# EAGLE design Power module Mini (EAGLE 9.6.1)
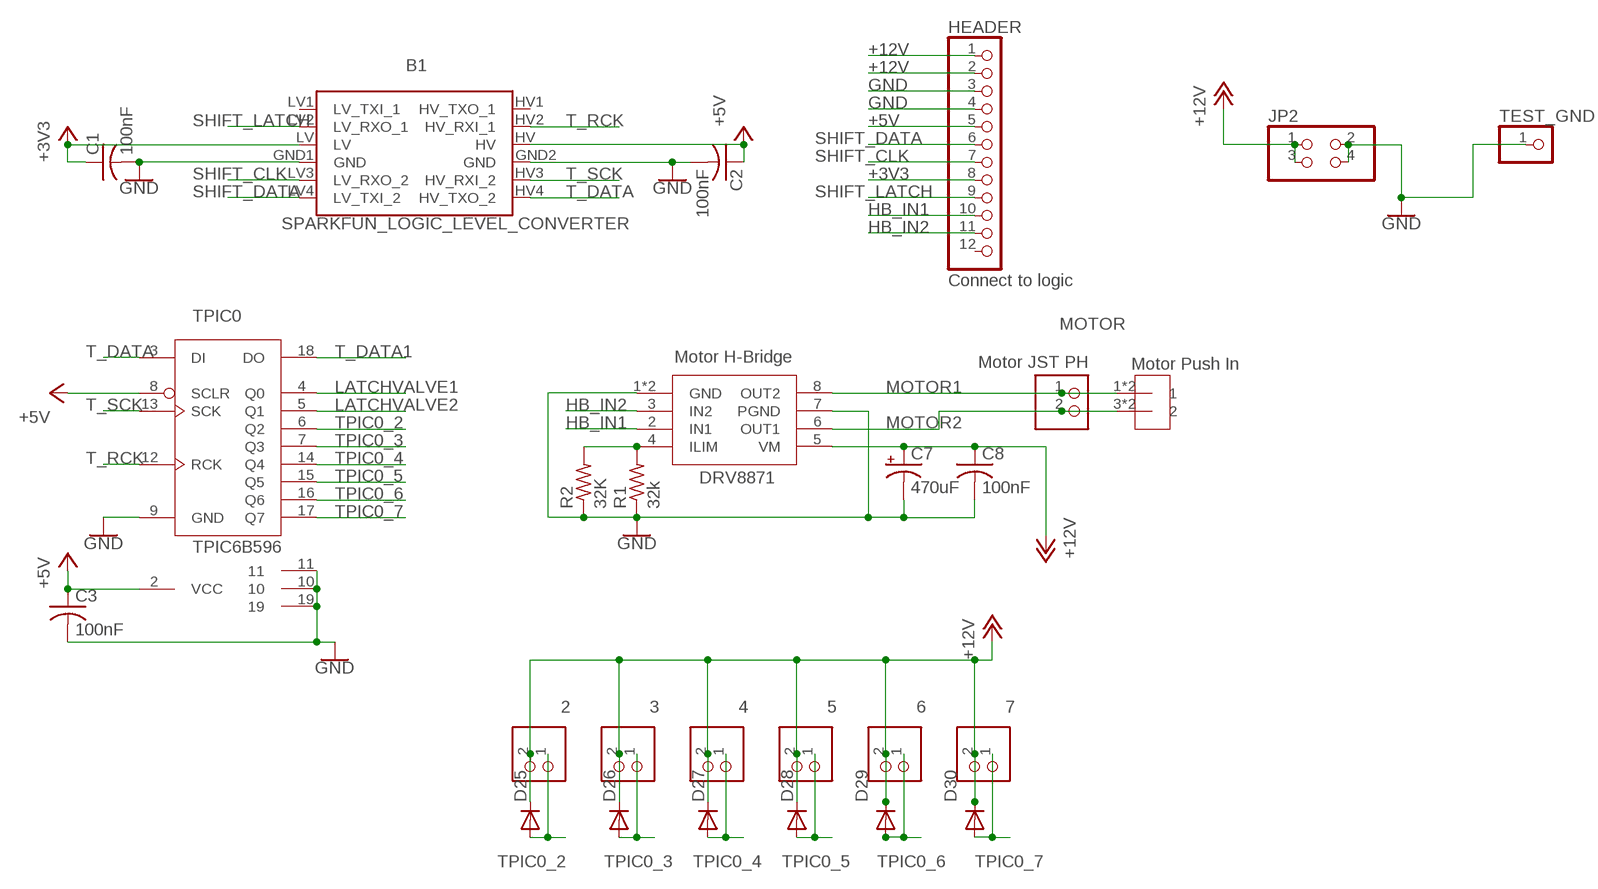
[diagram p0: schematic, sheet 1]

## Parts
2  2.5MM_JST_UP_2POS  [JST_2POS_2.5MM_UP]
3  2.5MM_JST_UP_2POS  [JST_2POS_2.5MM_UP]
4  2.5MM_JST_UP_2POS  [JST_2POS_2.5MM_UP]
5  2.5MM_JST_UP_2POS  [JST_2POS_2.5MM_UP]
6  2.5MM_JST_UP_2POS  [JST_2POS_2.5MM_UP]
7  2.5MM_JST_UP_2POS  [JST_2POS_2.5MM_UP]
B1  SPARKFUN_LOGIC_LEVEL_CONVERTER  [SPARKFUN_LOGIC_LEVEL_CONVERTER]
C1  100nF  C-USC1206  [C1206]
C2  100nF  C-USC1206  [C1206]
C3  100nF  C-USC1206  [C1206]
C7  470uF  CPOL-US140CLH-0810  [140CLH-0810]
C8  100nF  C-USC1206  [C1206]
D25  DIODESOD-123  [SOD-123]
D26  DIODESOD-123  [SOD-123]
D27  DIODESOD-123  [SOD-123]
D28  DIODESOD-123  [SOD-123]
D29  DIODESOD-123  [SOD-123]
D30  DIODESOD-123  [SOD-123]
DRV8871  Motor H-Bridge  DRV8871  [SOP8]
HEADER  Connect to logic  PINHD-1X12  [1X12]
JP2  PINHD-2X2  [2X02]
MOTOR  Motor JST PH  2.5MM_JST_UP_2POS  [JST_2POS_2.5MM_UP]
R1  32k  R-US_0204/5  [0204/5]
R2  32K  R-US_R0805  [R0805]
TEST_GND  PINHD-1X1  [1X01]
TPIC0  TPIC6B596  [DIP20]
U$1  Motor Push In  PUSH_IN_2  [3.5MM_DIP2]

## Nets
+3V3: B1.LV C1.1 HEADER.8
+5V: B1.HV C2.1 C3.1 HEADER.5 TPIC0.2(VCC) TPIC0.8(SCLR)
+12V: 2.2 3.2 4.2 5.2 6.2 7.2 C7.+ C8.1 D25.C D26.C D27.C D28.C D29.C D30.C DRV8871.5(VM) HEADER.1 HEADER.2 JP2.1 JP2.3
GND: B1.GND1(GND) B1.GND2(GND) C1.2 C2.2 C3.2 C7.- C8.2 DRV8871.1(GND) DRV8871.7(PGND) DRV8871.GND HEADER.3 HEADER.4 JP2.2 JP2.4 R1.1 R2.1 TEST_GND.1 TPIC0.9(GND) TPIC0.10 TPIC0.11 TPIC0.19
HB_IN1: DRV8871.2(IN1) HEADER.10
HB_IN2: DRV8871.3(IN2) HEADER.11
LATCHVALVE1: TPIC0.4(Q0)
LATCHVALVE2: TPIC0.5(Q1)
MOTOR1: DRV8871.8(OUT2) MOTOR.1 U$1.1 U$1.2
MOTOR2: DRV8871.6(OUT1) MOTOR.2 U$1.3 U$1.4
N$2: DRV8871.4(ILIM) R1.2 R2.2
SHIFT_CLK: B1.LV3(LV_RXO_2) HEADER.7
SHIFT_DATA: B1.LV4(LV_TXI_2) HEADER.6
SHIFT_LATCH: B1.LV2(LV_RXO_1) HEADER.9
T_DATA: B1.HV4(HV_TXO_2) TPIC0.3(DI)
T_DATA1: TPIC0.18(DO)
T_RCK: B1.HV2(HV_RXI_1) TPIC0.12(RCK)
T_SCK: B1.HV3(HV_RXI_2) TPIC0.13(SCK)
TPIC0_2: 2.1 D25.A TPIC0.6(Q2)
TPIC0_3: 3.1 D26.A TPIC0.7(Q3)
TPIC0_4: 4.1 D27.A TPIC0.14(Q4)
TPIC0_5: 5.1 D28.A TPIC0.15(Q5)
TPIC0_6: 6.1 D29.A TPIC0.16(Q6)
TPIC0_7: 7.1 D30.A TPIC0.17(Q7)
Unconnected: B1.HV1(HV_TXO_1) B1.LV1(LV_TXI_1) HEADER.12

## Library data of the parts
2-7 MOTOR = eDNA:2.5MM_JST_UP_2POS
B1 = SparkFun-Boards:SPARKFUN_LOGIC_LEVEL_CONVERTER: SparkFun Logic Level Converter -Bi-Directional This is the mechnical outline for the 3.3V - 5V bi directional logic level converter. *Note, the "LOCK" Package has the header pins staggered by an offset of 5 mils (off center line), so that when you slide a row of standard 0.1" headers into the PTH pads, it will hold position vertically. See the follwing turorial for more information on this type of special footprints: Sneaky Footprints <https://www.sparkfun.com/tutorials/114> SparkFun Products: SparkFun Logic Level Converter - Bi-Directional <https://www.sparkfun.com/products/12009>
C1-C3 C8 = rcl:C-US: CAPACITOR, American symbol; SPICEPREFIX: C
C7 = adafruit:CPOL-US: POLARIZED CAPACITOR, American symbol
D25-D30 = adafruit:DIODE: Diode SMADIODE - SMA Surface Mount Package 20V 1A Schottky Diode Digikey: 641-1014-6-ND DO-1N4148 - Through Hole Small Current Diode SOD-123 20V 1 A (.5mV Vf) Schottky Diode - Digikey: MBRX120TPMSCT-ND SOD-323 10V 570mA (.38mV Vf, 3ns) Schottky Diode - Digikey: ZLLS410CT-ND SOD-523 30V 30mA Schottky Diode (RB751S-40TE61) - Digikey: RB751S-40TE61CT-ND SOT23-R/W - SOT23 Package (R = Solder Paste/Reflow Ovens, W = Hand-Soldering) BAT54Film 40V 300mA - Digikey: 497-7162-1-ND
DRV8871 = eDNA:DRV8871
HEADER = adafruit:PINHD-1X12: PIN HEADER
JP2 = pinhead:PINHD-2X2: PIN HEADER
R1 = adafruit:R-US_: RESISTOR, American symbol
R2 = rcl:R-US_: RESISTOR, American symbol; SPICEPREFIX: R
TEST_GND = pinhead:PINHD-1X1: PIN HEADER
TPIC0 = eDNA:TPIC6B596
U$1 = eDNA:PUSH_IN_2: Push in to connect Phoenix Contact - 3.5 mm through hole Can be ordered from : https://www.digikey.com/product-detail/en/phoenix-contact/1864286/277-12184-ND/6605434 OpenSensingLab OSU

## Board
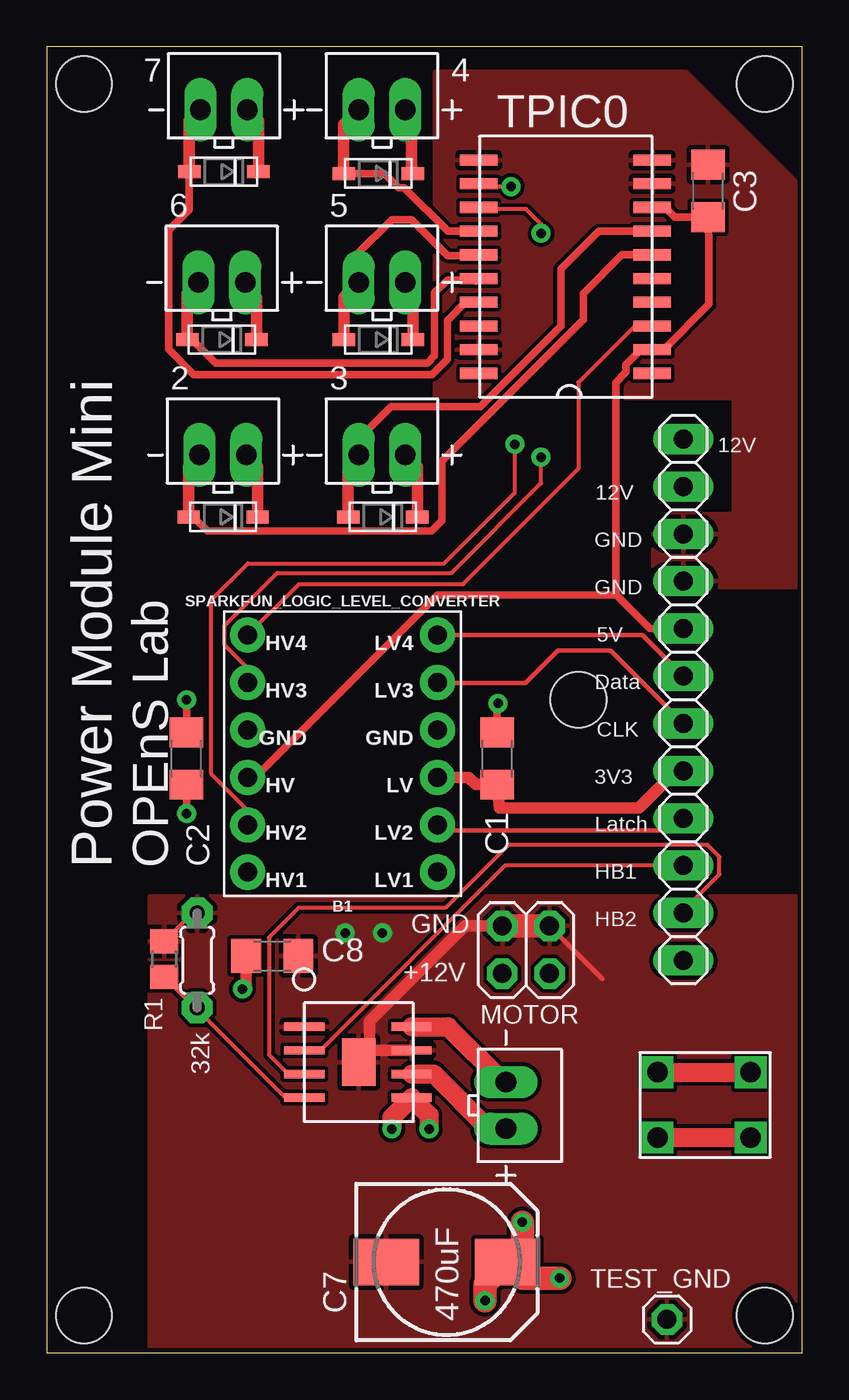
[diagram p1: board, top side]
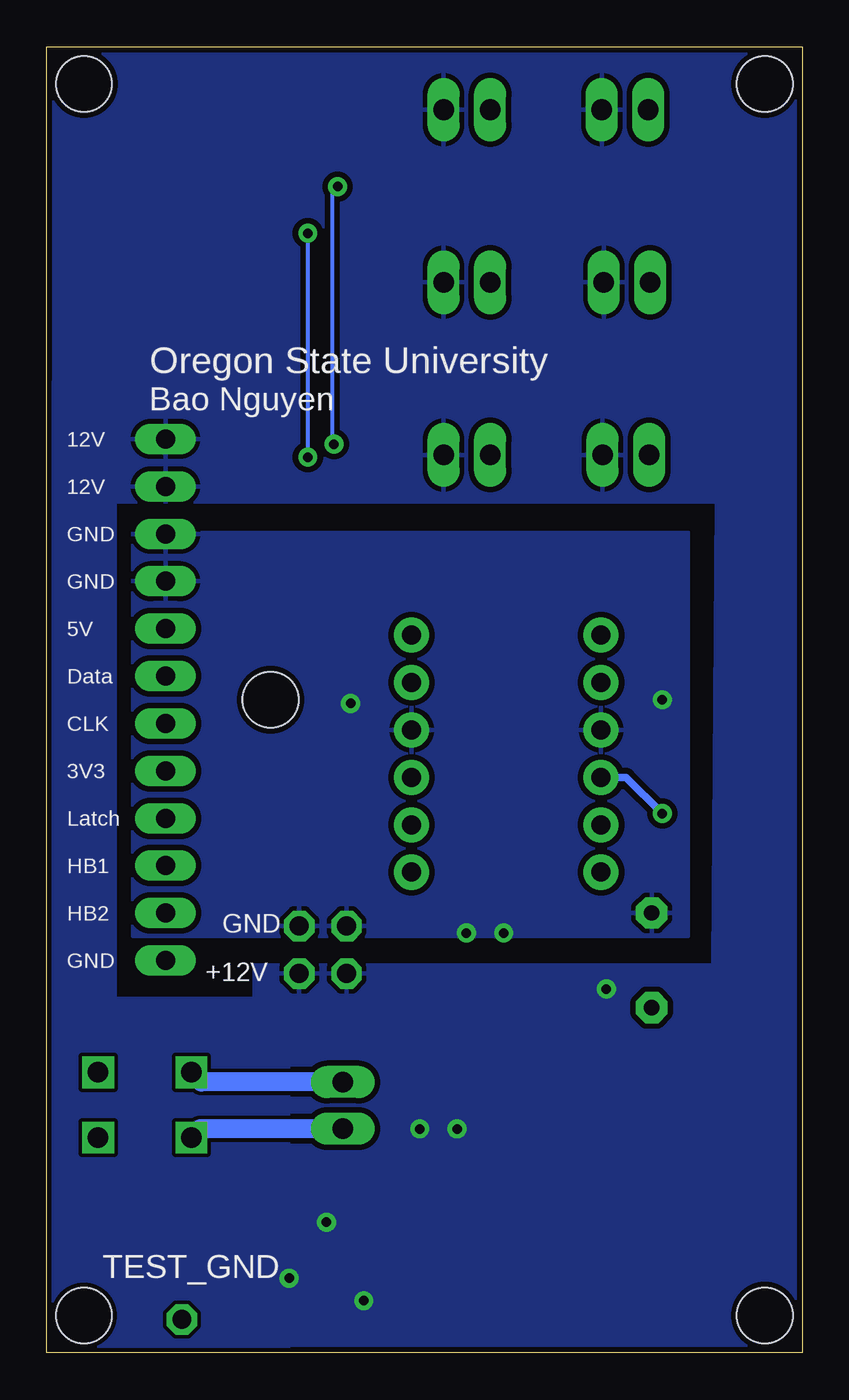
[diagram p2: board, bottom side, seen from below]

Size 40.5 x 70 mm. Coordinates in mm from the lower left corner, seen from the top.
Outline: 0,0 40.5,0 40.5,70 0,70 0,0
Copper layers (1*16): Top 0.035mm / dielectric 1.5mm / Bottom 0.035mm
Design rules "SparkFun": minimum track width 8mil, minimum drill 20mil, track to track 8mil, track to pad 8mil, pad to pad 8mil, via to via 8mil, smd to smd 8mil, copper to edge 10mil, drill to drill 8mil, minimum pad ring 12mil, minimum via ring 10mil, stop-mask expansion 4mil, vias tented up to drill 25mil, thermal gap 10mil
Holes 3 mm at 38.5,68 38.5,2 2,2 2,68 28.5,35

### Footprints (pad centres in the part's own frame; a part is rotated, then mirrored left to right if it is on the bottom)
JST_2POS_2.5MM_UP = drill 1.1 long: 1 -1.25,0; 2 1.25,0
SPARKFUN_LOGIC_LEVEL_CONVERTER = drill 1.016 pad 1.88: GND1 -5.08,-1.27; GND2 5.08,-1.27; HV 5.08,1.27; HV1 5.08,6.35; HV2 5.08,3.81; HV3 5.08,-3.81; HV4 5.08,-6.35; LV -5.08,1.27; LV1 -5.08,6.35; LV2 -5.08,3.81; LV3 -5.08,-3.81; LV4 -5.08,-6.35
C1206 = smd 1.6 x 1.8: 1 -1.4,0; 2 1.4,0
140CLH-0810 = smd 3.5 x 2.5: + 3.25,0; - -3.25,0
SOD-123 = smd 1.2 x 0.7: A 1.85,0; C -1.85,0
SOP8 = smd 2.15 x 0.45: 1 -2.54,1.27; 2 -2.54,0; 3 -2.54,-1.27; 4 -2.54,-2.54; 5 3.21,-2.54; 6 3.21,-1.27; 7 3.21,0; 8 3.21,1.27 | smd 1.79 x 2.541: GND 0.381,-0.635
1X12 = drill 1.016 long: 1 -13.97,0; 2 -11.43,0; 3 -8.89,0; 4 -6.35,0; 5 -3.81,0; 6 -1.27,0; 7 1.27,0; 8 3.81,0; 9 6.35,0; 10 8.89,0; 11 11.43,0; 12 13.97,0
2X02 = drill 1.016 octagon: 1 -1.27,-1.27; 2 -1.27,1.27; 3 1.27,-1.27; 4 1.27,1.27
0204/5 = drill 0.813 pad 1.676 octagon: 1 -2.54,0; 2 2.54,0
R0805 = smd 1.3 x 1.5: 1 -0.95,0; 2 0.95,0
1X01 = drill 1.016 octagon: 1 0,0
DIP20 = smd 2 x 0.6: 1 -3.81,5.08; 2 -3.81,3.81; 3 -3.81,2.54; 4 -3.81,1.27; 5 -3.81,0; 6 -3.81,-1.27; 7 -3.81,-2.54; 8 -3.81,-3.81; 9 -3.81,-5.08; 10 -3.81,-6.35; 11 5.49,-6.35; 12 5.49,-5.08; 13 5.49,-3.81; 14 5.49,-2.54; 15 5.49,-1.27; 16 5.49,0; 17 5.49,1.27; 18 5.49,2.54; 19 5.49,3.81; 20 5.49,5.08
3.5MM_DIP2 = drill 1.1 square: 1 -1.778,2.611; 2 -1.778,-2.389; 3 1.722,-2.389; 4 1.722,2.611

### Placement (x,y rotation side)
2  9.45,48.12 0 top
3  17.97,48.12 0 top
4  17.97,66.62 0 top
5  17.97,57.37 0 top
6  9.39,57.37 0 top
7  9.5,66.62 0 top
B1  15.86,32.11 180 top
C1  24.15,31.85 90 top
C2  7.5,31.85 90 top
C3  35.45,62.27 90 top
C7  21.45,4.87 0 top
C8  12.09,21.27 0 top
D25  9.46,44.8 180 top
D26  18.02,44.8 180 top
D27  17.78,63.2 180 top
D28  17.78,54.3 180 top
D29  9.39,54.3 180 top
D30  9.5,63.3 180 top
DRV8871  16.35,16.21 0 top
HEADER  34.13,35 270 top
JP2  25.69,21.6 0 top
MOTOR  24.62,13.26 270 top
R1  8.07,21.04 270 top
R2  6.3,21.1 270 top
TEST_GND  33.25,1.79 0 top
TPIC0  28.65,57.57 180 top
U$1  35.13,13.26 270 top

### Tracks (layer width: path | path; a pad name or v marks a point on that pad's centre or on a via)
+3V3
  Top 0.61: B1.LV 22.62,30.84 23.01,30.45 C1.1 24.26,29.2 31.74,29.2 33.73,31.19 HEADER.8
+5V  (via drill 0.51)
  Top 0.406: HEADER.5 32.34,38.81 30.55,40.61 | 30.55,40.61 30.5,40.65 30.5,52 31.05,52.55 31.05,52.96 31.86,53.76 TPIC0.2 32.5,53.8 33.1,53.8 35.5,56.2 35.5,59.68 C3.1 33.67,60.87 33.16,61.38 TPIC0.8 | 30.55,40.61 20.95,40.61 11.18,30.84 B1.HV | v7.5,28.9 C2.1
  Bottom 0.406: B1.HV 9.44,30.84 v7.5,28.9
+12V  (via drill 0.51)
  Top 0.61: 6.2 11.24,56.52 D29.C | 7.2 11.35,66.02 D30.C | D25.C 11.31,47.51 2.2 | D26.C 19.87,47.48 3.2 | D28.C 19.63,56.96 5.2 | 4.2 19.55,66.29 19.55,63.28 D27.C | C8.1 10.69,19.69 v10.5,19.5
  Top 1.016: v20.5,12 20.5,12.73 DRV8871.5 18.5,12.61 v18.5,12
  Top 1.27: C7.+ 25.5,5.67 v25.5,7 | C7.+ 23.5,3.67 v23.5,2.8 | C7.+ 25.57,4 v27.5,4
  pour Bottom (isolate 0.3): -0.1,69.8 40.4,69.8 40.4,45.6 4.64,45.6 4.83,20.8 29.4,20.8 29.4,-0.2 0.9,-0.2 -0.1,0.8
  pour Bottom: 36.5,46 36.5,52 40.5,52 40.5,0 27.5,0 27.5,19 36.8,19 36.8,46
GND  (via drill 0.51)
  Top 0.203: R1.1 7.83,23.58 R2.1
  Top 0.254: JP2.4 29.8,20.03
  Top 0.406: 17.37,16.21 DRV8871.GND | C2.2 v7.5,35 | C1.2 24.15,34.75 v24.2,34.8
  Top 0.61: JP2.2 22.43,22.87 17.32,17.76 17.32,16.16 17.37,16.21 DRV8871.7
  Top 1.27: JP2.4 JP2.2
  other vias: 16,22.5 18,22.5
  pour Top: 20.8,68.7 34.3,68.7 40.5,62.5 40.5,41 33.5,41 32.5,42 32.5,44 33.5,45 36.8,45 36.8,51.1 20.8,51.1
  pour Bottom (isolate 0.3): 35.9,44 6.1,44 6.1,22.3 35.9,22.3
  pour Top: 5.5,24.5 40.5,24.5 40.5,0 5.5,0
HB_IN1
  Top 0.203: HEADER.10 24.57,26.11 14.7,16.24 13.84,16.24 DRV8871.2
HB_IN2
  Top 0.203: HEADER.11 34.13,23.72 36.06,25.65 36.06,26.57 35.41,27.23 24.75,27.23 21.37,23.85 13.51,23.85 11.91,22.25 11.91,15.97 12.95,14.94 DRV8871.3
MOTOR1
  Top 1.016: DRV8871.8 21.52,17.48 24.49,14.51 MOTOR.1 | U$1.2 U$1.1
  Bottom 1.016: MOTOR.1 32.21,14.51 U$1.2
MOTOR2
  Top 1.016: DRV8871.6 20.76,14.94 23.58,12.12 MOTOR.2 | U$1.3 U$1.4
  Bottom 1.016: MOTOR.2 32.27,12.01 U$1.3
N$2
  Top 0.203: DRV8871.4 12.81,13.67 8.07,18.41 R1.2 7.95,18.5 R2.2
SHIFT_CLK
  Top 0.254: B1.LV3 20.96,35.9 25.66,35.9 27.41,37.64 30.22,37.64 HEADER.7
SHIFT_DATA
  Top 0.254: HEADER.6 31.93,38.47 B1.LV4
SHIFT_LATCH
  Top 0.254: B1.LV2 21.24,28 33.48,28 HEADER.9
T_DATA
  Top 0.203: TPIC0.3 31.53,55.03 28.5,52 28.5,47.38 22.32,41.2 13.52,41.2 B1.HV4
T_RCK  (via drill 0.51)
  Top 0.203: B1.HV2 10.78,29.08 8.83,31.03 8.83,40.34 10.79,42.31 21.31,42.31 25.1,46.1 v25.1,48.7 | v24.9,62.5 23.31,62.5 TPIC0.12
  Bottom 0.203: v25.1,48.7 25.2,48.8 25.2,62.2 v24.9,62.5
T_SCK  (via drill 0.51)
  Top 0.203: v26.5,60 26.5,60.5 25.7,61.3 23.24,61.3 TPIC0.13 | B1.HV3 10.78,36.7 9.53,37.94 9.53,38.98 12.36,41.8 21.7,41.8 26.5,46.6 v26.5,48
  Bottom 0.203: v26.5,48 v26.5,60
TPIC0_2
  Top 0.406: TPIC0.6 30.84,58.84 28.78,56.78 28.78,55.37 21.2,47.8 21.2,44.61 20.64,44.04 8.62,44.04 7.86,44.8 D25.A
  Top 0.61: D25.A 7.61,47.53 2.1
TPIC0_3
  Top 0.406: 3.1 16.72,48.98 18.45,50.7 23.25,50.7 27.57,55.02 27.57,58.07 29.61,60.11 TPIC0.7
  Top 0.61: 3.1 16.17,47.56 D26.A
TPIC0_4
  Top 0.406: D27.A 18.1,63.2 18.86,62.44 19.16,62.44 21.5,60.1 TPIC0.14
  Top 0.61: D27.A 15.93,65.82 4.1
TPIC0_5
  Top 0.406: TPIC0.15 23.12,58.8 21.49,58.8 19.55,60.74 18.51,60.74 16.61,58.84 16.61,57.48 5.1
  Top 0.61: D28.A 15.93,56.58 5.1
TPIC0_6
  Top 0.406: 22.96,57.5 23.02,57.43 TPIC0.16 22.96,57.5 | 22.96,57.5 21.49,57.5 20.8,56.81 20.8,53.44 20.4,53.04 9.05,53.04 7.79,54.3 D29.A
  Top 0.61: 6.1 7.54,56.77 D29.A
TPIC0_7
  Top 0.406: D30.A 7.65,61.27 6.54,60.16 6.54,53.78 7.88,52.43 20.66,52.43 21.48,53.26 21.48,55.32 22.46,56.3 TPIC0.17
  Top 0.61: D30.A 7.65,66.02 7.1

### Text on the board
tPlace: 12V | 12V | GND | GND | 5V | Data | CLK | 3V3 | Latch | Power Module Mini | OPEnS Lab | HB1 | HB2 | GND | +12V
bPlace: Oregon State University | Bao Nguyen | 12V | 12V | GND | GND | 5V | Data | CLK | 3V3 | Latch | HB1 | HB2 | GND | GND | +12V | TEST_GND